# EAGLE design rfid_box (EAGLE 7.2.0)
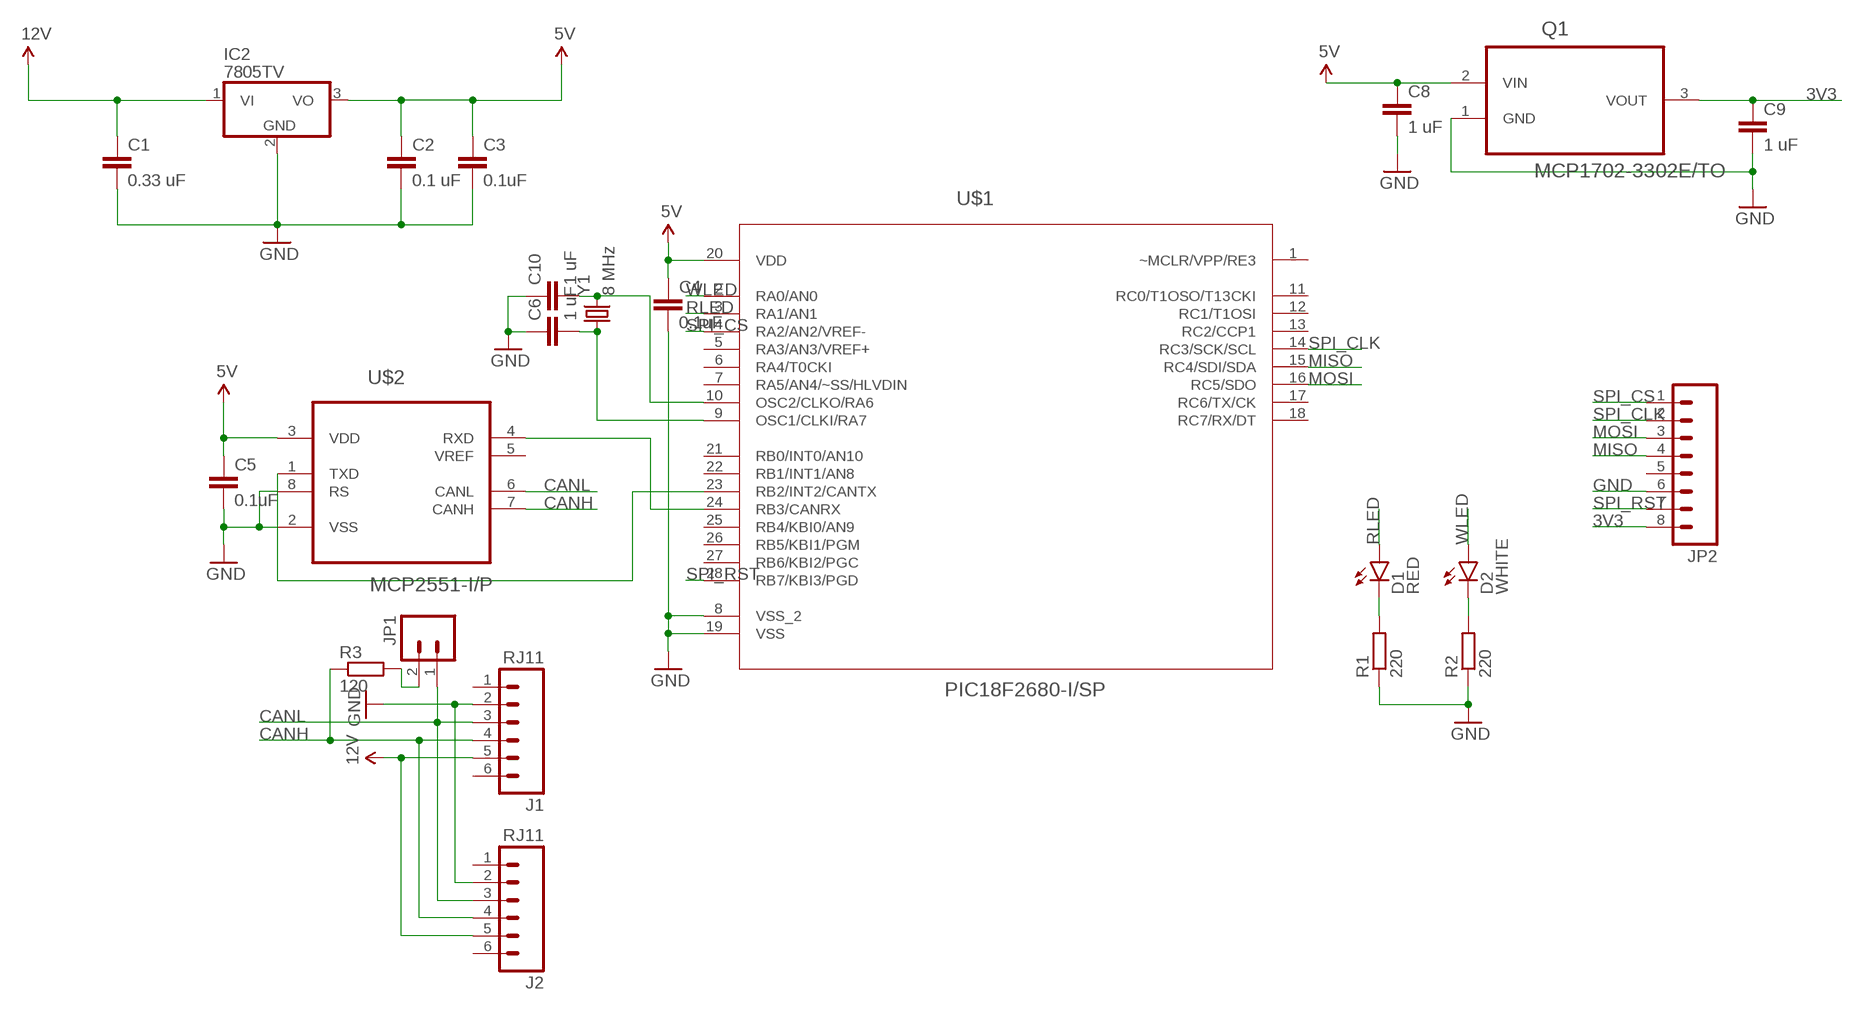
[diagram p0: schematic, sheet 1]

## Parts
C1  0.33 uF  C-EU050-030X075  [C050-030X075]
C2  0.1 uF  C-EU050-030X075  [C050-030X075]
C3  0.1uF  C-EU050-030X075  [C050-030X075]
C4  0.1uF  C-EU050-030X075  [C050-030X075]
C5  0.1uF  C-EU050-030X075  [C050-030X075]
C6  1 uF  C-EU025-025X050  [C025-025X050]
C8  1 uF  C-EU050-030X075  [C050-030X075]
C9  1 uF  C-EU050-030X075  [C050-030X075]
C10  1 uF  C-EU025-025X050  [C025-025X050]
D1  RED  LED5MM  [LED5MM]
D2  WHITE  LED5MM  [LED5MM]
IC2  7805TV  [TO220V]
J1  RJ11  RJ11-6PTH  [RJ11-6]
J2  RJ11  RJ11-6PTH  [RJ11-6]
JP1  M02PTH  [1X02]
JP2  M08  [1X08_ROUND]
Q1  MCP1702-3302E/TO  [TO127P254X533-3]
R1  220  R-EU_0207/10  [0207/10]
R2  220  R-EU_0207/10  [0207/10]
R3  120  R-EU_0207/10  [0207/10]
U$1  PIC18F2680-I/SP  [DIP254P762X508-28]
U$2  MCP2551-I/P  [DIP254P762X432-8]
Y1  8 MHz  CRYSTALHC49US  [HC49US]

## Nets
3V3: C9.1 JP2.8 Q1.3(VOUT)
5V: C2.1 C3.1 C4.1 C5.1 C8.1 IC2.3(VO) Q1.2(VIN) U$1.20(VDD) U$2.3(VDD)
12V: C1.1 IC2.1(VI) J1.5 J2.5
CANH: J1.4 J2.4 R3.1 U$2.7(CANH)
CANL: J1.3 J2.3 JP1.1 U$2.6(CANL)
GND: C1.2 C2.2 C3.2 C4.2 C5.2 C6.1 C8.2 C9.2 C10.1 IC2.2(GND) J1.2 J2.2 JP2.6 Q1.1(GND) R1.1 R2.1 U$1.8(VSS_2) U$1.19(VSS) U$2.2(VSS) U$2.8(RS)
MISO: JP2.4 U$1.15(RC4/SDI/SDA)
MOSI: JP2.3 U$1.16(RC5/SDO)
N$1: U$1.24(RB3/CANRX) U$2.4(RXD)
N$2: U$1.23(RB2/INT2/CANTX) U$2.1(TXD)
N$3: C10.2 U$1.10(OSC2/CLKO/RA6) Y1.2
N$4: C6.2 U$1.9(OSC1/CLKI/RA7) Y1.1
N$7: D1.K(C) R1.2
N$8: D2.K(C) R2.2
N$9: JP1.2 R3.2
RLED: D1.A U$1.3(RA1/AN1)
SPI_CLK: JP2.2 U$1.14(RC3/SCK/SCL)
SPI_CS: JP2.1 U$1.4(RA2/AN2/VREF-)
SPI_RST: JP2.7 U$1.28(RB7/KBI3/PGD)
WLED: D2.A U$1.2(RA0/AN0)
Unconnected: J1.1 J1.6 J2.1 J2.6 JP2.5 U$1.1(~MCLR/VPP/RE3) U$1.5(RA3/AN3/VREF+) U$1.6(RA4/T0CKI) U$1.7(RA5/AN4/~SS/HLVDIN) U$1.11(RC0/T1OSO/T13CKI) U$1.12(RC1/T1OSI) U$1.13(RC2/CCP1) U$1.17(RC6/TX/CK) U$1.18(RC7/RX/DT) U$1.21(RB0/INT0/AN10) U$1.22(RB1/INT1/AN8) U$1.25(RB4/KBI0/AN9) U$1.26(RB5/KBI1/PGM) U$1.27(RB6/KBI2/PGC) U$2.5(VREF)

## Library data of the parts
C1-C6 C8-C10 = rcl:C-EU: CAPACITOR, European symbol
D1 D2 = SparkFun-LED:LED: LEDs Standard schematic elements and footprints for 5mm, 3mm, 1206, and 0603 sized LEDs. 5mm - Spark Fun Electronics SKU : COM-00529 (and others)
IC2 = linear:78*: Positive VOLTAGE REGULATOR Source: http://cache.national.com/ds/LM/LM78L05.pdf http://www.fairchildsemi.com/ds/LM/LM7805.pdf
J1 J2 = SparkFun-Connectors:RJ11-6: RJ11 Jack Simple 6 pin RJ11 jack. Commonly found on CAT3 devices and Microchip programmers. SKU: PRT-00132; PROD_ID: CONN-08590
JP1 = SparkFun-Connectors:M02: Standard 2-pin 0.1" header. Use with - straight break away headers ( PRT-00116) - right angle break away headers (PRT-00553) - swiss pins (PRT-00743) - machine pins (PRT-00117) - female headers (PRT-00115) Molex polarized connector foot print use with: PRT-08233 with associated crimp pins and housings. 2.54_SCREWTERM for use with PRT-10571. 3.5mm Screw Terminal footprints for PRT-08084 5mm Screw Terminal footprints for use with PRT-08432
JP2 = SparkFun-Connectors:M08: Header 8 Standard 8-pin 0.1" header. Use with straight break away headers (SKU : PRT-00116), right angle break away headers (PRT-00553), swiss pins (PRT-00743), machine pins (PRT-00117), and female headers (PRT-00115).
Q1 = Microchip_By_element14_Batch_1:MCP1702-3302E/TO: IC, V REG, LDO, 250MA; MPN: MCP1702-3302E/TO; OC_FARNELL: 1331485; OC_NEWARK: 34M7419; PACKAGE: TO-92; SUPPLIER: Microchip
R1-R3 = rcl:R-EU_: RESISTOR, European symbol
U$1 = Microchip_By_element14_Batch_1:PIC18F2680-I/SP: Enhanced Flash Microcontrollers ;; DESCRIPTION: Enhanced Flash Microcontrollers; MPN: PIC18F2680-I/SP; OC_FARNELL: 1212700; OC_NEWARK: 96K3941; PACKAGE: DIP-28; SUPPLIER: Microchip
U$2 = Microchip_By_element14_Batch_1:MCP2551-I/P: High-Speed CAN Transceiver; DESCRIPTION: CAN CTRL; MPN: MCP2551-I/P; OC_FARNELL: 1292240; OC_NEWARK: 61K2947; PACKAGE: PDIP-8; SUPPLIER: Microchip
Y1 = SparkFun-FreqCtrl:CRYSTAL: Various standard crystals. Proven footprints.

## Board
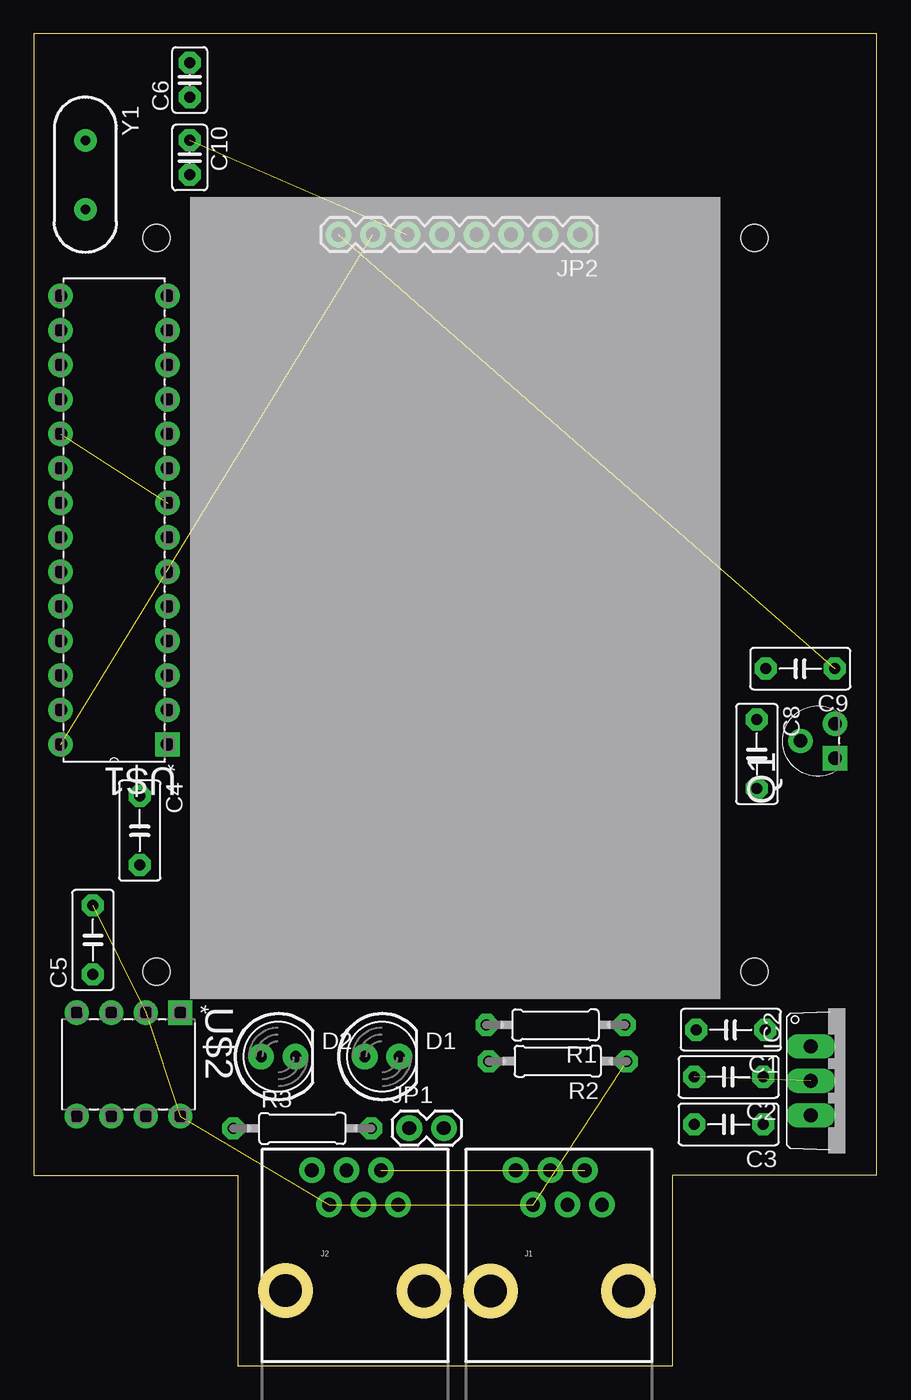
[diagram p1: board, top side]
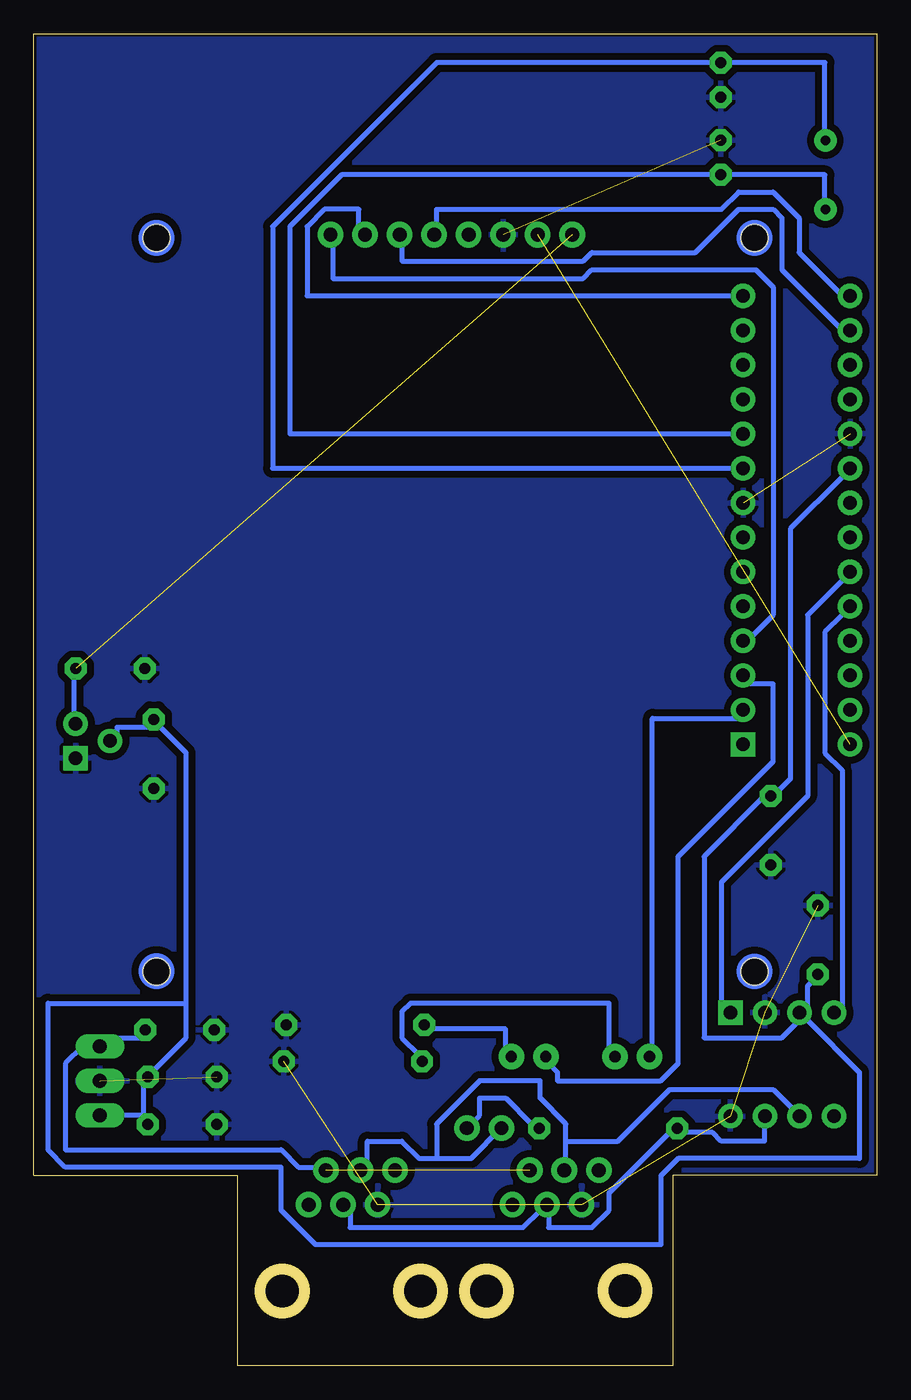
[diagram p2: board, bottom side, seen from below]

Size 62 x 98 mm. Coordinates in mm from the lower left corner, seen from the top.
Outline: 62,14 62,98 0,98 0,14 15,14 15,0 47,0 47,14 62,14
Outline: circle at 43.74,5.48 radius 1.6
Outline: circle at 33.58,5.48 radius 1.6
Outline: circle at 28.71,5.48 radius 1.6
Outline: circle at 18.52,5.51 radius 1.6
Copper layers (1*16): Top 0.035mm / dielectric 1.5mm / Bottom 0.035mm
Design rules "x1": minimum track width 15mil, minimum drill 32mil, track to track 20mil, track to pad 20mil, pad to pad 20mil, via to via 8mil, smd to smd 8mil, copper to edge 8mil, drill to drill 8mil, minimum pad ring 0.4mm, minimum via ring 0.4mm, stop-mask expansion 4mil, vias tented up to drill 20mil, thermal gap 10mil
Holes 2 mm at 9,29 53,29 9,83 53,83

### Footprints (pad centres in the part's own frame; a part is rotated, then mirrored left to right if it is on the bottom)
C050-030X075 = drill 0.813 octagon: 1 -2.54,0; 2 2.54,0
C025-025X050 = drill 0.813 octagon: 1 -1.27,0; 2 1.27,0
LED5MM = drill 0.813 pad 1.88: A -1.27,0; K 1.27,0
TO220V = drill 1.016 long: 1 -2.54,-2.54; 2 0,-2.54; 3 2.54,-2.54
RJ11-6 = drill 1.016 pad 1.88: 1 -3.175,8.89; 2 -1.905,6.35; 3 -0.635,8.89; 4 0.635,6.35; 5 1.905,8.89; 6 3.175,6.35 | hole 3.251: -5.08,0; 5.08,0
1X02 = drill 1.016 pad 1.88: 1 0,0; 2 2.54,0
1X08_ROUND = drill 1.016 pad 1.88: 1 0,0; 2 2.54,0; 3 5.08,0; 4 7.62,0; 5 10.16,0; 6 12.7,0; 7 15.24,0; 8 17.78,0
TO127P254X533-3 = drill 0.991 square: 1 -2.54,-2.54 | drill 0.991: 2 -1.27,0; 3 0,-2.54
0207/10 = drill 0.813 octagon: 1 -5.08,0; 2 5.08,0
DIP254P762X508-28 = drill 0.991 square: 1 -7.874,33.02 | drill 0.991: 2 -7.874,30.48; 3 -7.874,27.94; 4 -7.874,25.4; 5 -7.874,22.86; 6 -7.874,20.32; 7 -7.874,17.78; 8 -7.874,15.24; 9 -7.874,12.7; 10 -7.874,10.16; 11 -7.874,7.62; 12 -7.874,5.08; 13 -7.874,2.54; 14 -7.874,0; 15 0,0; 16 0,2.54; 17 0,5.08; 18 0,7.62; 19 0,10.16; 20 0,12.7; 21 0,15.24; 22 0,17.78; 23 0,20.32; 24 0,22.86; 25 0,25.4; 26 0,27.94; 27 0,30.48; 28 0,33.02
DIP254P762X432-8 = drill 0.991 square: 1 -7.62,7.62 | drill 0.991: 2 -7.62,5.08; 3 -7.62,2.54; 4 -7.62,0; 5 0,0; 6 0,2.54; 7 0,5.08; 8 0,7.62
HC49US = drill 0.7 pad 1.651: 1 -2.54,0; 2 2.54,0

### Placement (x,y rotation side)
C1  51.27,24.71 180 top
C2  51.1,21.24 180 top
C3  51.1,17.75 180 top
C4  7.78,39.37 270 top
C5  4.33,31.32 90 top
C6  11.46,94.61 90 top
C8  53.18,45.01 270 top
C9  56.38,51.28 180 top
C10  11.46,88.9 270 top
D1  25.61,22.73 0 top
D2  17.98,22.73 0 top
IC2  59.69,20.95 270 top
J1  38.62,5.49 0 top
J2  23.62,5.49 0 top
JP1  27.61,17.48 0 top
JP2  40.18,83.23 180 top
Q1  56.4,47.24 90 top
R1  38.37,25.07 180 top
R2  38.53,22.39 180 top
R3  19.75,17.45 0 top
U$1  1.96,78.73 180 top
U$2  3.15,18.35 270 top
Y1  3.78,87.63 270 top

### Tracks (layer width: path | path; a pad name or v marks a point on that pad's centre or on a via)
3V3  (1 unrouted)
  Bottom 0.381: C9.1 59.05,50.8 59.05,47.62 Q1.3
5V
  Bottom 0.381: Q1.2 55.88,46.35 55.88,46.99 53.34,46.99 C8.1 52.7,46.99 50.8,45.09 50.8,26.67 | 53.98,18.41 53.98,20.95 C2.1 53.34,21.59 50.8,24.13 50.8,26.67 | 53.98,18.41 53.98,17.78 C3.1 53.98,18.41 | 53.98,18.41 IC2.3 | C5.1 4.45,28.57 5.08,27.94 5.08,26.04 U$2.3 | U$1.20 2.54,65.41 6.35,61.59 6.35,43.18 7.62,41.91 C4.1 8.26,41.91 12.7,37.47 12.7,24.13 6.99,24.13 5.71,25.4 U$2.3 | 50.8,26.67 60.96,26.67 60.96,15.88 59.69,14.61 43.81,14.61 43.81,11.43 41.27,8.89 15.88,8.89 15.88,13.97 14.61,15.24 1.27,15.24 1.27,21.59 5.08,25.4 U$2.3
12V  (1 unrouted)
  Bottom 0.381: C1.1 53.98,24.13 57.15,24.13 IC2.1 58.42,23.5 59.69,22.23 59.69,15.88 43.81,15.88 42.55,14.61 40.64,14.61 J1.5
CANH
  Bottom 0.381: U$2.7 8.26,17.78 8.26,16.51 11.43,16.51 12.06,17.14 14.61,17.14 R3.1 15.24,17.14 19.68,12.7 19.68,11.43 20.95,10.16 24.13,10.16 24.13,11.43 J2.4 24.77,11.43 26.04,10.16 38.73,10.16 38.73,11.43 J1.4
CANL
  Bottom 0.381: JP1.1 29.84,15.24 32.38,15.24 | 32.38,15.24 33.66,15.24 34.92,16.51 37.47,16.51 37.47,14.61 J1.3 | 22.86,16.51 19.05,16.51 15.24,20.32 7.62,20.32 5.71,18.41 U$2.6 | 22.86,16.51 22.86,14.61 J2.3 | 32.38,15.24 32.38,17.78 29.21,20.95 24.77,20.95 24.77,19.68 22.86,17.78 22.86,16.51
GND  (8 unrouted)
  pour Bottom: 15,14 0,14 0,98 62,98 62,14 47,14 47,0 15,0
MISO
  Bottom 0.381: U$1.15 2.54,78.74 5.71,81.92 5.71,84.45 7.62,86.36 10.16,86.36 11.43,85.09 32.38,85.09 32.38,83.82 JP2.4
MOSI
  Bottom 0.381: U$1.16 2.54,76.2 6.99,80.64 6.99,84.45 7.62,85.09 10.16,85.09 13.34,81.92 20.95,81.92 21.59,81.28 34.92,81.28 34.92,83.19 JP2.3
N$1
  Bottom 0.381: U$2.4 2.54,26.04 2.54,43.81 3.81,45.09 3.81,53.98 2.54,55.24 U$1.24
N$2
  Bottom 0.381: U$2.1 10.79,26.04 11.43,26.67 11.43,35.56 5.08,41.91 5.08,55.24 2.54,57.78 U$1.23
N$3
  Bottom 0.381: Y1.2 3.81,85.09 3.81,87.63 C10.2 39.37,87.63 43.18,83.82 43.18,68.58 10.16,68.58 U$1.10
N$4
  Bottom 0.381: Y1.1 3.81,90.17 3.81,95.89 C6.2 32.38,95.89 44.45,83.82 44.45,66.04 10.16,66.04 U$1.9
N$7
  Bottom 0.381: R1.2 33.02,24.77 27.3,24.77 27.3,22.86 D1.K
N$8
  Bottom 0.381: R2.2 33.66,22.86 34.92,24.13 34.92,26.04 34.29,26.67 19.68,26.67 19.68,22.86 D2.K
N$9
  Bottom 0.381: JP1.2 29.21,18.41 29.21,19.68 27.3,19.68 25.4,17.78 R3.2
RLED
  Bottom 0.381: U$1.3 9.53,50.16 7.62,50.16 7.62,44.45 14.61,37.47 14.61,22.23 15.88,20.95 23.5,20.95 23.5,21.59 24.13,22.23 D1.A
SPI_CLK
  Bottom 0.381: U$1.14 10.16,78.74 41.91,78.74 41.91,83.82 40.64,85.09 38.1,85.09 38.1,83.82 JP2.2
SPI_CS
  Bottom 0.381: U$1.4 9.53,53.34 7.62,55.24 7.62,79.38 8.89,80.64 20.95,80.64 21.59,80.01 40.01,80.01 40.01,83.19 JP2.1
SPI_RST  (1 unrouted)
WLED
  Bottom 0.381: U$1.2 10.16,47.62 16.51,47.62 16.51,22.86 D2.A
(copper drawn outside any net)
  shapes: Bottom circle x4